# Altium schematic sheet MOUNTING.SchDoc
size 420 x 297 mm; SheetNumber: 7; SheetTotal: 7
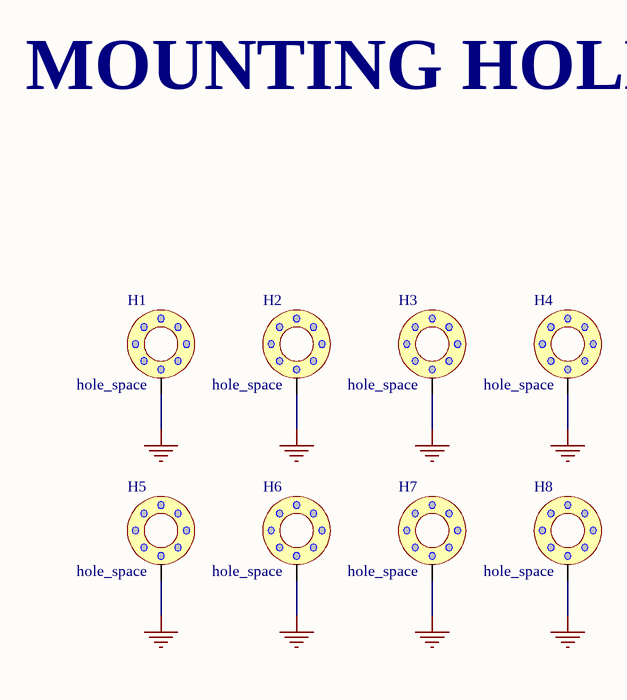
[diagram p0: MOUNTING.SchDoc]

## Parts
H1  hole_space  [HEX-M3_NoVia_Smaller]
H2  hole_space  [HEX-M3_NoVia_Smaller]
H3  hole_space  [HEX-M3_NoVia_Smaller]
H4  hole_space  [HEX-M3_NoVia_Smaller]
H5  hole_space  [HEX-M3_NoVia_Smaller]
H6  hole_space  [HEX-M3_NoVia_Smaller]
H7  hole_space  [HEX-M3_NoVia_Smaller]
H8  hole_space  [HEX-M3_NoVia_Smaller]

## Nets
GND: H1.1 H2.1 H3.1 H4.1 H5.1 H6.1 H7.1 H8.1

## Notes on the sheet
- MOUNTING HOLE
- Project:
- Sub-system:
- Design by:
- Sheet title:
- Sheet
- A3
- of
- Checked by:
- Approved by:
- Revision:
- Document No:
- Size:
- Date: